# Altium schematic sheet POWERR.SchDoc
size A4; SheetNumber: 2; SheetTotal: 2
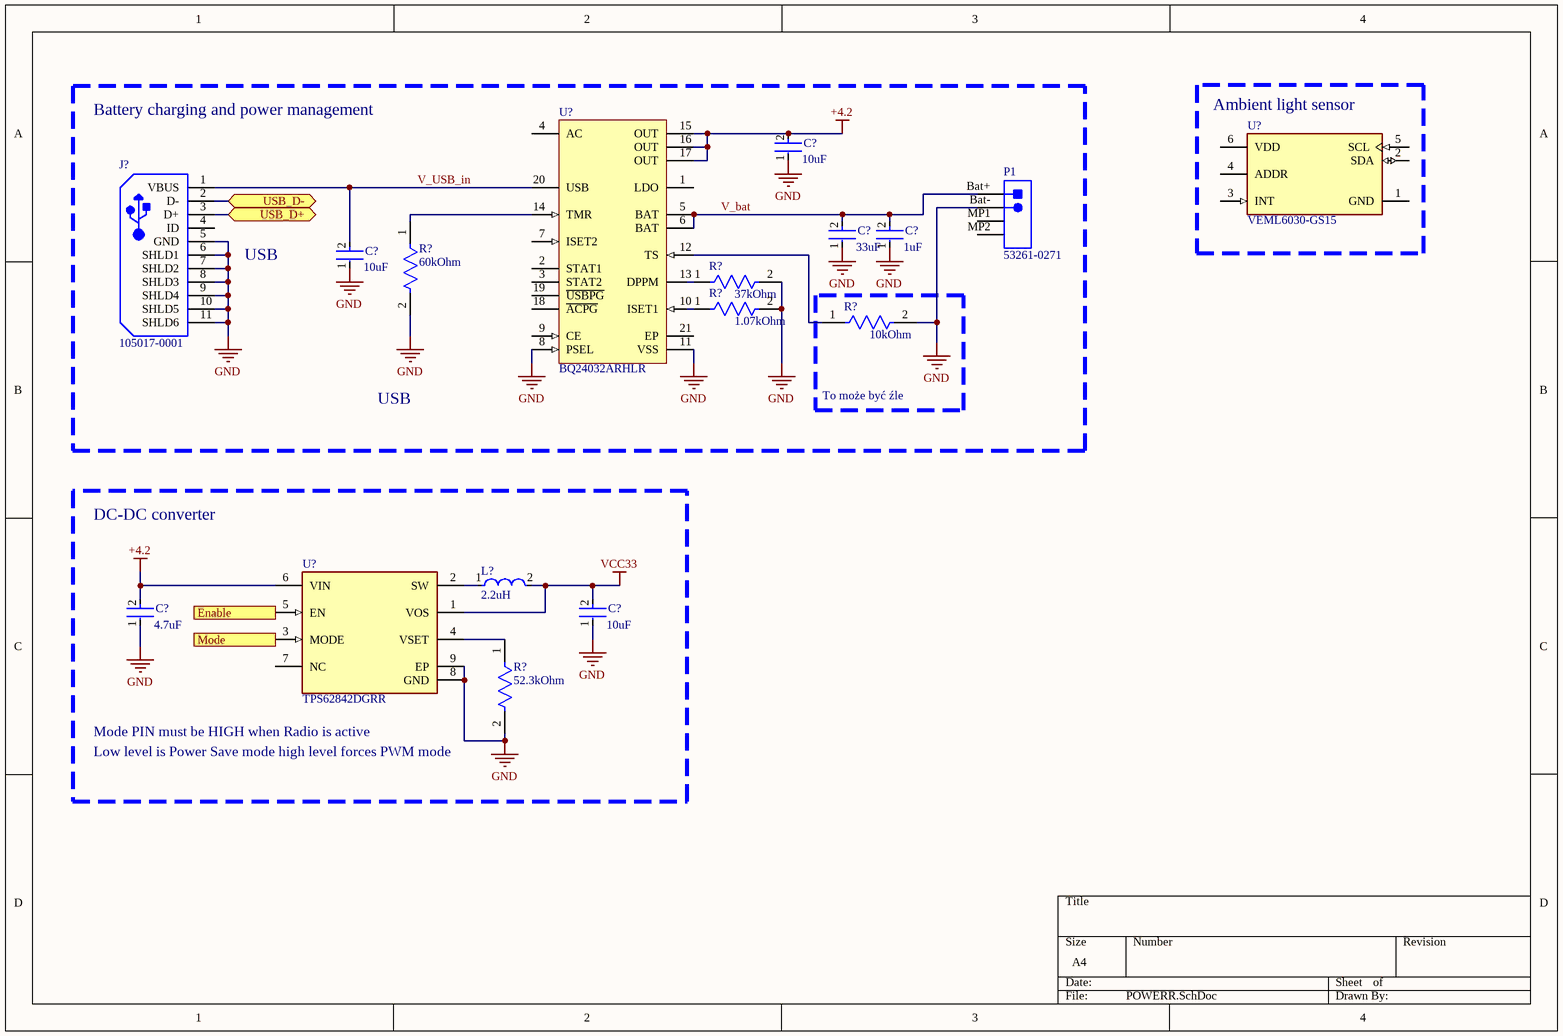
[diagram p0: POWERR.SchDoc]

## Parts
(Parts that share a designator on the sheet are numbered #1, #2 ... from top to bottom, then left to right.)
C?#1  Capacitance: 10uF  [FP-0603-L_1_6_0_2-W_0_8_0-MFG]  (hidden comment: LMK107BBJ106MAHT)
C?#2  Capacitance: 33uF  [FP-0603-L_1_6_0_2-W_0_8_0-MFG]  (hidden comment: LMK107BBJ106MAHT)
C?#3  Capacitance: 1uF  [FP-0603-L_1_6_0_2-W_0_8_0-MFG]  (hidden comment: LMK107BBJ106MAHT)
C?#4  Capacitance: 10uF  [FP-0603-L_1_6_0_2-W_0_8_0-MFG]  (hidden comment: LMK107BBJ106MAHT)
C?#5  Capacitance: 4.7uF  [FP-0603-L_1_6_0_2-W_0_8_0-MFG]  (hidden comment: LMK107BBJ106MAHT)
C?#6  Capacitance: 10uF  [FP-0603-L_1_6_0_2-W_0_8_0-MFG]  (hidden comment: LMK107BBJ106MAHT)
J?  105017-0001  [USB-MICRO-B_V]
L?  Inductance: 2.2uH  [FP-LQM18NN_00-IPC_C]
P1  53261-0271  [MOLX-53261-0271_V]
R?#1  Resistance: 60kOhm  [FP-RN731J-MFG]  (hidden comment: RN731JTTD3702F100)
R?#2  Resistance: 37kOhm  [FP-RN731J-MFG]  (hidden comment: RN731JTTD3702F100)
R?#3  value 1.07kOhm  [FP-RP73P-1J-MFG]  (hidden comment: RP73PF1J1K07BTDF)
R?#4  Resistance: 10kOhm  [FP-RN731J-MFG]  (hidden comment: RN731JTTD3702F100)
R?#5  Resistance: 52.3kOhm  [FP-RN731J-MFG]  (hidden comment: RN731JTTD3702F100)
U?#1  BQ24032ARHLR  [RHL0020A_V]
U?#2  VEML6030-GS15  [FP-6_550-5348_01-4-MFG]
U?#3  TPS62842DGRR  [FP-DGR0008A-MFG]

## Blocks framed on the sheet
Ambient light sensor: U?#2
To może być źle: R?#4
DC-DC converter: C?#5 C?#6 L? R?#5 U?#3

## Ports
Enable (in), Mode (in), USB_D+ (bidir, see MCU[3B]), USB_D- (bidir, see MCU[3B])

## Nets
+4.2: C?#1.2 C?#5.2 U?#1.15(OUT) U?#1.16(OUT) U?#1.17(OUT) U?#3.6(VIN)
GND: C?#1.1 C?#2.1 C?#3.1 C?#4.1 C?#5.1 C?#6.1 J?.5(GND) J?.6(SHLD1) J?.7(SHLD2) J?.8(SHLD3) J?.9(SHLD4) J?.10(SHLD5) J?.11(SHLD6) P1.Bat- R?#1.2 R?#2.2 R?#3.2 R?#4.2 R?#5.2 U?#1.8(PSEL) U?#1.11(VSS) U?#3.8(GND) U?#3.9(EP)
VCC33: C?#6.2 L?.2 U?#3.1(VOS)
Enable: U?#3.5(EN) ; port Enable
Mode: U?#3.3(MODE) ; port Mode
USB_D+: J?.3(D+) ; port USB_D+
USB_D-: J?.2(D-) ; port USB_D-
V_bat: C?#2.2 C?#3.2 P1.Bat+ U?#1.5(BAT) U?#1.6(BAT)
V_USB_in: C?#4.2 J?.1(VBUS) U?#1.20(USB)
NetL?_1: L?.1 U?#3.2(SW)
NetR?#1_1: R?#1.1 U?#1.14(TMR)
NetR?#2_1: R?#2.1 U?#1.13(DPPM)
NetR?#3_1: R?#3.1 U?#1.10(ISET1)
NetR?#4_1: R?#4.1 U?#1.12(TS)
NetR?#5_1: R?#5.1 U?#3.4(VSET)

Not connected (* = marked no-connect by the designer): J? 4(ID); P1 MP1 MP2; U?#1 1(LDO) 2(STAT1) 3(STAT2) 4(AC) 7(ISET2) 9(CE) 18(~{ACPG}) 19(~{USBPG}) 21(EP); U?#2 1(GND) 2(SDA) 3(INT) 4(ADDR) 5(SCL) 6(VDD); U?#3 7(NC)

## Notes on the sheet
- Battery charging and power management
- USB
- (near U?#3) Mode PIN must be HIGH when Radio is active
- (near R?#5) Low level is Power Save mode high level forces PWM mode

## Library data of the parts
C?#1 C?#3 C?#4 C?#6 = CMP-14477-003294-2: None; Dielectric: X5R; Tolerance: 20%; Voltage Rating (DC): 10V; Thickness: 0.035inch; Package Quantity: 4000; Case Code (Metric): 1608; RoHS Compliant: Yes; Height: 0.8mm; Lead Free: Lead Free; Min Operating Temperature: -55°C; Packaging: Tape and Reel; Length: 1.6mm; Case/Package: 0603; Case Code (Imperial): 0603; Width: 0.8mm; Halogen Free: Halogen Free; Max Operating Temperature: 85°C; Ratings: AEC-Q200; Voltage Rating: 10V; Termination: SMD/SMT; Mount: Surface Mount
C?#2 = CMP-14477-003294-2: Umożliwia pracę bez baterii; Dielectric: X5R; Tolerance: 20%; Voltage Rating (DC): 10V; Thickness: 0.035inch; Package Quantity: 4000; Case Code (Metric): 1608; RoHS Compliant: Yes; Height: 0.8mm; Lead Free: Lead Free; Min Operating Temperature: -55°C; Packaging: Tape and Reel; Length: 1.6mm; Case/Package: 0603; Case Code (Imperial): 0603; Width: 0.8mm; Halogen Free: Halogen Free; Max Operating Temperature: 85°C; Ratings: AEC-Q200; Voltage Rating: 10V; Termination: SMD/SMT; Mount: Surface Mount
C?#5 = CMP-14477-003294-2: Dielectric: X5R; Tolerance: 20%; Voltage Rating (DC): 10V; Thickness: 0.035inch; Package Quantity: 4000; Case Code (Metric): 1608; RoHS Compliant: Yes; Height: 0.8mm; Lead Free: Lead Free; Min Operating Temperature: -55°C; Packaging: Tape and Reel; Length: 1.6mm; Case/Package: 0603; Case Code (Imperial): 0603; Width: 0.8mm; Halogen Free: Halogen Free; Max Operating Temperature: 85°C; Ratings: AEC-Q200; Voltage Rating: 10V; Termination: SMD/SMT; Mount: Surface Mount
J? = CMP-2000-05827-1: Micro-USB B Receptacle, Right Angle, Bottom Mount, Surface Mount, with Solder Tabs, -30 to 85 degC, 5-Pin USB, RoHS, Tape and Reel; Manufacturer: Molex; Featured Product: Micro-USBConnectorsUSBConnectors; Other Names: WM1399DKR; Package Version: Rev. F, 12/2012; Number of Contacts: 5; Connector Type: USB-microB; Catalog Drawings: 1050170001; 3D Model: 105017-0001.stp; Mating Products: WM17145-ND-CABLEMICROUSBBTOSTDA1.0MWM17147-ND-CABLEMICROUSBBTOSTDA2.0MWM17146-ND-CABLEMICROUSBBTOSTDA1.5M; PCN Assembly/Origin: ResinSupplier21/Oct/2015; Voltage - Max: 30V; Online Catalog: Molex-MicroUSB; Manufacturer URL: http://www.molex.com/; Package Description: 5-Leads USB, Micro B, Body 7.5 x 5 mm, Pitch 0.65 mm; Datasheet URL: http://www.molex.com/elqNow/elqRedir.htm?ref=http://www.molex.com/webdocs/datasheets/pdf/en-us/1050170001_IO_CONNECTORS.pdf; Ingress Protection: -; Datasheet Version: 03/2016; Mounting Type: BoardCutout,SurfaceMount,RightAngle; Circuits: 5; Standard Package: 1; Package Reference: MICRO-B; Package URL: http://www.molex.com/pdm_docs/sd/1050170001_sd.pdf; Category: Connectors,Interconnects; Series: -; RoHS Information: 1050170001CertofCompliance; Features: Shielded,SolderRetention; Family: USB,DVI,HDMIConnectors; Specifications: -; Gender: Receptacle; Packaging: Digi-Reel®; Mounting Technology: SurfaceMount
L? = CMP-06042-016797-1: 0603 initially 2.2uH; Test Frequency: 25MHz; DC Current: 50mA; Inductor Type: MONOLITHIC; Tolerance: 10%; Self Resonant Frequency: 205MHz; Core Material: Ferrite; DC Resistance (DCR): 500mR; Q Factor: 15; Shielding: Shielded; Case/Package: 0603; Min Operating Temperature: -40°C; Height - Seated (Max): 0.035inch; Packaging: Tape and Reel; Series: LQM18N; Package Quantity: 4000; Max Operating Temperature: 85°C; Radiation Hardening: No; Max DC Current: 50mA; Mount: Surface Mount; Military Standard: Not; Number of Pins: 2; REACH SVHC: No SVHC; Width: 0.8mm; Inductance Tolerance: 10%; Case Code (Imperial): 0603; Case Code (Metric): 1608; Height: 0.8mm; Depth: 0.95mm; Current Rating: 50mA; Length: 1.6mm; RoHS Compliant: Yes; Termination: SMD/SMT
P1 = CMP-2000-05633-1: PicoBlade(TM) Header, Right Angle, -40 to 85 degC, 2-Pin SMD, RoHS, Tape and Reel; Current - Max: 1A; Brand: Molex; Voltage Rating: 125V; Number of Positions: 2; Pitch: 1.25mm; Package Version: Rev. H, 11/2014; Factory Pack Quantity: 1000; Datasheet URL: http://www.molex.com/webdocs/datasheets/pdf/en-us/0532610271_PCB_HEADERS.pdf; Datasheet Version: 03/2016; Housing Material: Thermoplastic; RoHS: Details; Product Type: Headers; Number of Rows: 1; Termination Style: SMD; Mounting Technology: SurfaceMount; Number of Positions / Contacts: 2; Package URL: http://www.molex.com/pdm_docs/sd/532610271_sd.pdf; Mounting Angle: Right; Mounting Style: SMD/SMT; Manufacturer: Molex; Product Category: 1.25mmConnectors; Tradename: PicoBlade; Voltage - Max: 125V; Manufacturer URL: http://www.molex.com/; Series: 53261; Package Description: 2-Leads Header, Pitch 1.25 mm, Mated Height 3.4 mm; Package Reference: 53261-0271; Current Rating: 1A; Contact Plating: Tin; Contact Material: PhosphorBronze; Type: Shrouded; Packaging: Reel
R?#1 R?#2 R?#4 = CMP-04015-056702-1: 37kΩ ±1% 0.063W, 1/16W Chip Resistor 0603 (1608 Metric) Moisture Resistant Thin Film; Temperature Coefficient: 10ppm/°C; Voltage Rating: 50V; Power Rating: 63mW; Termination: SMD/SMT; Weight: 7.1E-05oz; Composition: Thin Film; Height: 0.45mm; Max Operating Temperature: 125°C; Packaging: Tape and Reel; Length: 1.6mm; Min Operating Temperature: -55°C; Case Code (Imperial): 0603; Tolerance: 1%; Case/Package: 0603; Width: 0.8mm; Case Code (Metric): 1608
R?#3 = CMP-03211-001820-1: RES SMD 1.07K OHM 0.1% 1/6W 0603; Manufacturer: TE Connectivity; Voltage Rating: 100V; Temperature Coefficient: 25ppm/°C; Power Rating: 0.166W; Tolerance: 0.001; Height: 0.55mm; Manufacturer Part Number: RP73PF1J1K07BTDF; Device Class L2: Resistors; Category: Res; Lead Free: Yes; Ipc Land Pattern Name: RESC15580X45; RoHS: TRUE; ComponentLink2URL: https://www.te.com/commerce/DocumentDelivery/DDEController?Action=srchrtrv&DocNm=1773272&DocType=DS&DocLang=English; Temperature: -55°C to +155°C; Temperature Range Low: -55°C; Device Class L1: Passive Components; Resistance: 1.07kOhm; Package: RP73P-1J; Octopart: https://octopart.com/rp73pf1j1k07btdf-te+connectivity-45465727; Automotive: No; Series: RP73P; Composition: Thin Film; Device Class L3: Chip SMD Resistors; ComponentLink2Description: Datasheet; Temperature Range High: +155°C; Digikey Description: RES SMD 1.07K OHM 0.1% 1/6W 0603; Mouser Description: TE CONNECTIVITY - RP73PF1J1K07BTDF - RES, THIN FILM, 1K07, 0.1%, 0.166W, 0603
R?#5 = CMP-04015-056702-1: Temperature Coefficient: 10ppm/°C; Voltage Rating: 50V; Tolerance: 1%; Power Rating: 63mW; Termination: SMD/SMT; Weight: 7.1E-05oz; Composition: Thin Film; Height: 0.45mm; Max Operating Temperature: 125°C; Packaging: Tape and Reel; Length: 1.6mm; Min Operating Temperature: -55°C; Case Code (Imperial): 0603; Case/Package: 0603; Width: 0.8mm; Case Code (Metric): 1608
U?#1 = CMP-0321-00146-2: Dual Input Li-Ion Charger with Dynamic Power Path, Output regulated to 4.4 V, Vbat 4.2 V, 4.3 V, -40 to 85 degC, 20-pin QFN (RHL), Green (RoHS & no Sb/Br); Manufacturer: Texas Instruments; Vin(Min)(V): 4.3; Li-Ion: Y; SubFamily: Battery Charge Management; NiCd: N; Mounting Technology: Surface Mount; DatasheetVersion: SLUS618H; PackageReference: RHL0020A; PartNumber: BQ24032ARHLR; Li-Polymer: Y; ComponentLink1Description: Datasheet; Over Voltage Protection: N; Eco-Plan: Green (RoHS & no Sb/Br); PackageVersion: revJ, Dec-2011; ComponentLink1URL: http://www.ti.com/general/docs/lit/getliterature.tsp?genericPartNumber=BQ24032A&fileType=pdf; Lead Acid: N; PackageDescription: 20-Leads Plastic Quad Flatpack No-Lead, 4.5 x 3.5 x 0.9 mm Body, 0.5 mm Pitch, Exposed Pad; NiMH: N
U?#2 = CMP-00030-75380597-1: VEML6030-GS15 Light to Digital Ambient Light Sensor Digital 3.3V 6-Pin T/R; RoHS: Non-Compliant; NexarPartId: 75380597
U?#3 = CMP-04918-000211-1: STEP DOWN CONVERTER; RoHS Compliant: Yes